# Altium project ir.PRJPCB
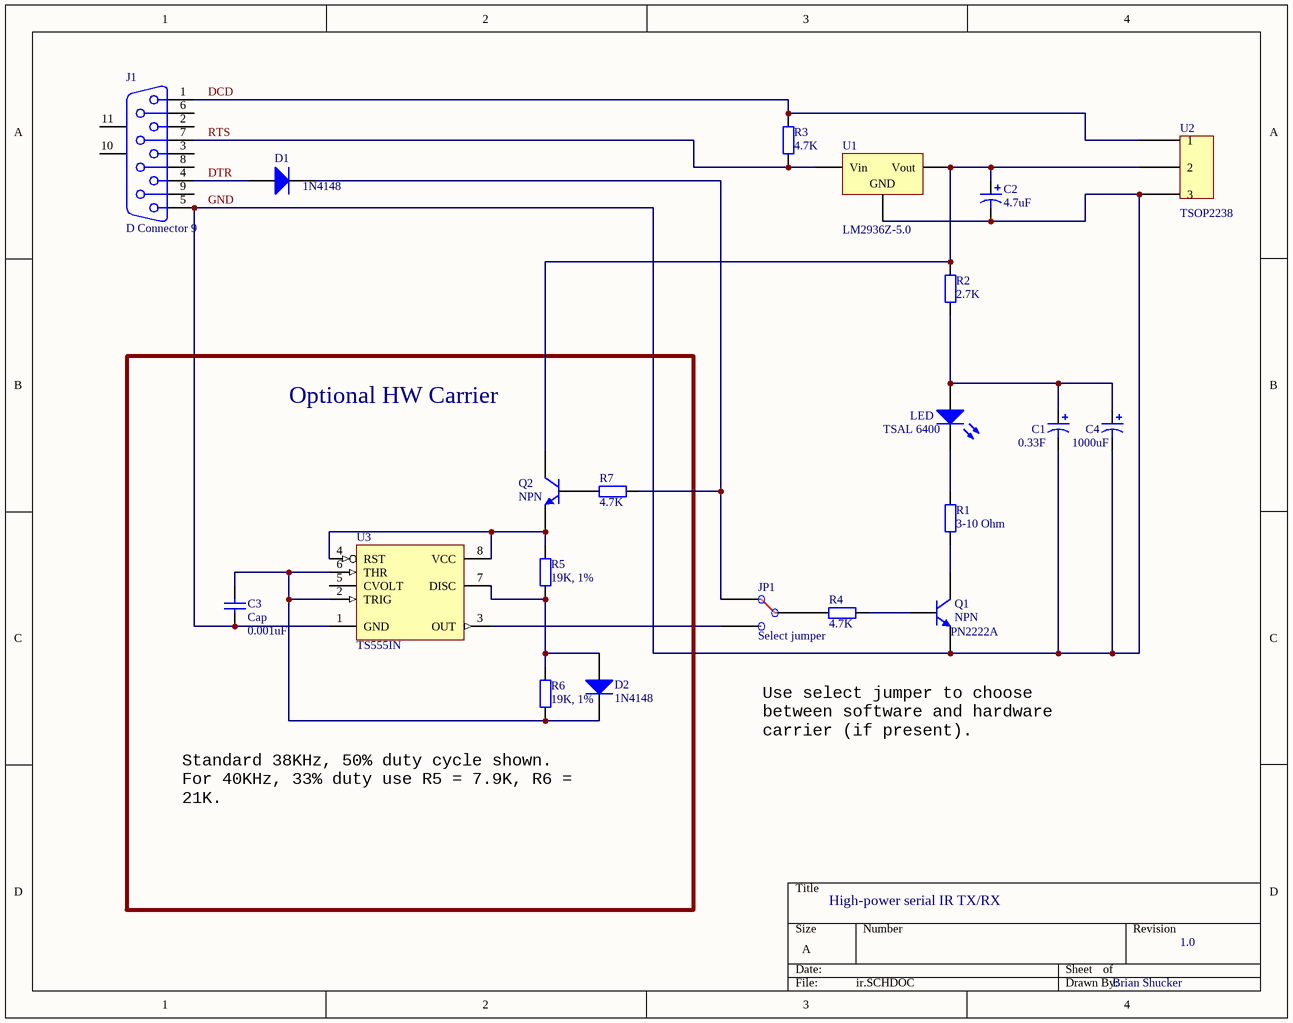
[diagram p0: ir.SCHDOC]
1 sheet, 21 parts. Net scope: global (net labels, ports and power ports of the same name join across sheets).
Board file: ir.PCBDOC

## Sheet ir.SCHDOC
size A; PageSetup: Record=PageOptions|CenterHorizontal=True|CenterVertical=True|PrintScale=1.05|XCorrection=1.00|YCorrection=1.00|PrintKind=1|BorderSize=5000000|LeftOffset=0|BottomOffset=0|Orientation=2|PaperLength=1000|PaperWidth=1000|Scale=100|PaperSource=7|PrintQuality=-4|MediaType=1|DitherType=10|PaperKind=Letter|PrintScaleMode=1

### Parts
C1  0.33F  [SuperCapacitor]
C2  value 4.7uF  [CAPPR1.5-4x5]  (hidden comment: Cap Pol1)
C3  Cap  value 0.001uF  [Axial-0.1]
C4  1000uF  [Cap 10mm (5mm lead space)]
D1  1N4148  [DIO7.1-3.9x1.9]
D2  1N4148  [DIO7.1-3.9x1.9]
J1  D Connector 9  [DSUB1.385-2H9]
JP1  Select jumper  [Select Jumper]
LED  TSAL 6400  [LED]
Q1  NPN  [TO-92]
Q2  NPN  [TO-92]
R1  3-10 Ohm  [AXIAL-0.5]
R2  2.7K  [AXIAL-0.4]
R3  4.7K  [AXIAL-0.4]
R4  value 4.7K  [AXIAL-0.4]  (hidden comment: Res2)
R5  value 19K, 1%  [AXIAL-0.4]  (hidden comment: Res2)
R6  value 19K, 1%  [AXIAL-0.4]  (hidden comment: Res2)
R7  value 4.7K  [AXIAL-0.4]  (hidden comment: Res2)
U1  LM2936Z-5.0  [TO-92 straight]
U2  TSOP2238  [vishay1]
U3  TS555IN  [DIP8]

### Blocks framed on the sheet
Optional HW Carrier: C3 D2 Q2 R5-R7 U3

### Nets
DCD: J1.1 R3.2 U2.1
DTR: D1.1(A) J1.4
GND: C1.2 C2.2 C3.1 C4.2 J1.5 Q1.3(E) U1.2(GND) U2.3 U3.1(GND)
RTS: J1.7 R3.1 U1.1(Vin)
NetC1_1: C1.1 C4.1 LED.1(A) R2.1
NetC2_1: C2.1 Q2.1(C) R2.2 U1.3(Vout) U2.2
NetC3_2: C3.2 D2.2(K) R6.1 U3.2(TRIG) U3.6(THR)
NetD1_2: D1.2(K) JP1.1 R7.1
NetD2_1: D2.1(A) R5.1 R6.2 U3.7(DISC)
NetJP1_2: JP1.2 R4.1
NetJP1_3: JP1.3 U3.3(OUT)
NetLED_2: LED.2(K) R1.2
NetQ1_1: Q1.1(C) R1.1
NetQ1_2: Q1.2(B) R4.2
NetQ2_2: Q2.2(B) R7.2
NetQ2_3: Q2.3(E) R5.2 U3.4(RST) U3.8(VCC)

Not connected (* = marked no-connect by the designer): J1 2 3 6 8 9 10(MH1) 11(MH2); U3 5(CVOLT)

### Notes on the sheet
- (near Q1) PN2222A
- Use select jumper to choose between software and hardware carrier (if present).
- Standard 38KHz, 50% duty cycle shown.
  For 40KHz, 33% duty use R5 = 7.9K, R6 = 21K.
- High-power serial IR TX/RX
- 1.0
- Brian Shucker

### Library data of the parts
C1 C2 C4 = Cap Pol1: Polarized Capacitor (Radial); Published: 8-Jun-2000; LatestRevisionDate: 17-Jul-2002; LatestRevisionNote: Re-released for DXP Platform.; Publisher: Altium Limited
  C1: Value: 0.33F
  C4: Value: 1000uF
C3 = Cap: Capacitor; Published: 8-Jun-2000; LatestRevisionDate: 17-Jul-2002; LatestRevisionNote: Re-released for DXP Platform.; Publisher: Altium Limited
D1 D2 = Diode 1N4148: High Conductance Fast Diode; Published: 8-Jun-2000; LatestRevisionDate: 17-Jul-2002; LatestRevisionNote: Re-released for DXP Platform.; DatasheetDocument: 1997; PackageReference: DO-35; Publisher: Altium Limited; Code_JEDEC: DO-204-AH
J1 = D Connector 9: Receptacle Assembly, 9 Position, Right Angle; PackageDocument: O; Positions: 9; Published: 15-Jun-2001; LatestRevisionDate: 17-Jul-2002; LatestRevisionNote: Re-released for DXP Platform.; DatasheetDocument: 1-Sep-1999; PackageReference: 788750; Publisher: Altium Limited; Orientation: Right Angle; Gender: Receptacle
JP1 = Select jumper: Jumper switch: 1 common, 2 poles
LED = LED0: Typical INFRARED GaAs LED; Published: 8-Jun-2000; LatestRevisionDate: 17-Jul-2002; LatestRevisionNote: Re-released for DXP Platform.; Publisher: Altium Limited
Q1 Q2 = NPN: NPN Bipolar Transistor; Published: 8-Jun-2000; LatestRevisionDate: 17-Jul-2002; LatestRevisionNote: Re-released for DXP Platform.; Publisher: Altium Limited; Code_JEDEC: TO-226-AA
R1-R7 = Res2: Resistor; Published: 8-Jun-2000; LatestRevisionDate: 17-Jul-2002; LatestRevisionNote: Re-released for DXP Platform.; Publisher: Altium Limited
  R1: Value: 3-10 Ohm
  R2: Value: 2.7K
  R3: Value: 4.7K
U1 = Volt Reg: Voltage Regulator; Published: 24-Mar-1999; LatestRevisionDate: 17-Jul-2002; LatestRevisionNote: Re-released for DXP Platform.; Publisher: Altium Limited; Code_JEDEC: SMD-220
U2 = TSOP2238 IR RECEIVER MODULE
U3 = TS555IN: Low-Power Single CMOS Timer; Published: 24-Aug-2001; LatestRevisionDate: 17-Jul-2002; LatestRevisionNote: Re-released for DXP Platform.; DatasheetDocument: Jan-1999; PackageReference: DIP8; Publisher: Altium Limited; Code_JEDEC: MO-001-AN